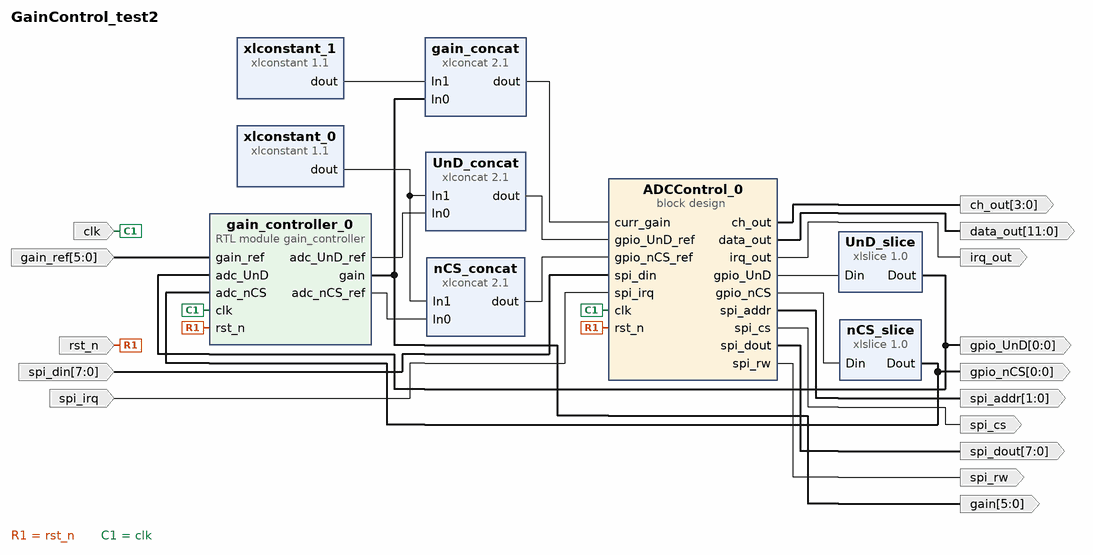
[diagram p0: block diagram of the top level]
# Vivado block design GainControl_test2, xczu3eg-sbva484-1-i, Vivado 2020.2
create_bd_design GainControl_test2

create_bd_port -dir O spi_rw
create_bd_port -dir O spi_cs
create_bd_port -dir O -from 7 -to 0 spi_dout
create_bd_port -dir O irq_out
create_bd_port -dir O -from 1 -to 0 spi_addr
create_bd_port -dir O -from 11 -to 0 data_out
create_bd_port -dir O -from 3 -to 0 ch_out
create_bd_port -dir I -from 7 -to 0 spi_din
create_bd_port -dir I -type rst rst_n
create_bd_port -dir I -type clk clk
create_bd_port -dir I spi_irq
create_bd_port -dir O -from 5 -to 0 gain
create_bd_port -dir I -from 5 -to 0 gain_ref
create_bd_port -dir O -from 0 -to 0 gpio_UnD
create_bd_port -dir O -from 0 -to 0 gpio_nCS

create_bd_cell -type module -reference gain_controller gain_controller_0
create_bd_cell -type ip -vlnv xilinx.com:ip:xlconcat:2.1 UnD_concat
set_property -dict {CONFIG.IN1_WIDTH 3 CONFIG.NUM_PORTS 2} [get_bd_cells UnD_concat]
create_bd_cell -type ip -vlnv xilinx.com:ip:xlconcat:2.1 nCS_concat
set_property -dict {CONFIG.IN1_WIDTH 3 CONFIG.NUM_PORTS 2} [get_bd_cells nCS_concat]
create_bd_cell -type ip -vlnv xilinx.com:ip:xlconstant:1.1 xlconstant_0
set_property -dict {CONFIG.CONST_VAL 0 CONFIG.CONST_WIDTH 3} [get_bd_cells xlconstant_0]
create_bd_cell -type ip -vlnv xilinx.com:ip:xlconcat:2.1 gain_concat
set_property -dict {CONFIG.IN0_WIDTH 6 CONFIG.IN1_WIDTH 18 CONFIG.NUM_PORTS 2} [get_bd_cells gain_concat]
create_bd_cell -type ip -vlnv xilinx.com:ip:xlconstant:1.1 xlconstant_1
set_property -dict {CONFIG.CONST_VAL 0 CONFIG.CONST_WIDTH 18} [get_bd_cells xlconstant_1]
create_bd_cell -type ip -vlnv xilinx.com:ip:xlslice:1.0 UnD_slice
set_property -dict {CONFIG.DIN_WIDTH 4} [get_bd_cells UnD_slice]
create_bd_cell -type ip -vlnv xilinx.com:ip:xlslice:1.0 nCS_slice
set_property -dict {CONFIG.DIN_WIDTH 4} [get_bd_cells nCS_slice]
create_bd_cell -type container -reference ADCControl ADCControl_0
set_property -dict [list \
  CONFIG.ACTIVE_SIM_BD ADCControl.bd \
  CONFIG.ACTIVE_SYNTH_BD ADCControl.bd \
  CONFIG.ENABLE_DFX 0 \
  CONFIG.LIST_SIM_BD ADCControl.bd \
  CONFIG.LIST_SYNTH_BD ADCControl.bd \
  CONFIG.LOCK_PROPAGATE 0 \
] [get_bd_cells ADCControl_0]

# ---- connections ----

connect_bd_net -net rst_n_0_1 [get_bd_ports rst_n] [get_bd_pins gain_controller_0/rst_n] [get_bd_pins ADCControl_0/rst_n]
connect_bd_net -net clk_0_1 [get_bd_ports clk] [get_bd_pins gain_controller_0/clk] [get_bd_pins ADCControl_0/clk]
connect_bd_net -net gain_ref_0_1 [get_bd_ports gain_ref] [get_bd_pins gain_controller_0/gain_ref]
connect_bd_net [get_bd_pins gain_controller_0/adc_UnD_ref] [get_bd_pins UnD_concat/In0]
connect_bd_net [get_bd_pins gain_controller_0/adc_nCS_ref] [get_bd_pins nCS_concat/In0]
connect_bd_net [get_bd_pins xlconstant_0/dout] [get_bd_pins nCS_concat/In1] [get_bd_pins UnD_concat/In1]
connect_bd_net [get_bd_pins gain_controller_0/gain] [get_bd_ports gain] [get_bd_pins gain_concat/In0]
connect_bd_net [get_bd_pins xlconstant_1/dout] [get_bd_pins gain_concat/In1]
connect_bd_net [get_bd_pins UnD_slice/Dout] [get_bd_ports gpio_UnD] [get_bd_pins gain_controller_0/adc_UnD]
connect_bd_net [get_bd_pins nCS_slice/Dout] [get_bd_ports gpio_nCS] [get_bd_pins gain_controller_0/adc_nCS]
connect_bd_net [get_bd_pins ADCControl_0/ch_out] [get_bd_ports ch_out]
connect_bd_net [get_bd_pins ADCControl_0/data_out] [get_bd_ports data_out]
connect_bd_net [get_bd_pins ADCControl_0/irq_out] [get_bd_ports irq_out]
connect_bd_net [get_bd_pins ADCControl_0/spi_addr] [get_bd_ports spi_addr]
connect_bd_net [get_bd_pins ADCControl_0/spi_cs] [get_bd_ports spi_cs]
connect_bd_net [get_bd_pins ADCControl_0/spi_dout] [get_bd_ports spi_dout]
connect_bd_net [get_bd_pins ADCControl_0/spi_rw] [get_bd_ports spi_rw]
connect_bd_net [get_bd_pins ADCControl_0/gpio_UnD] [get_bd_pins UnD_slice/Din]
connect_bd_net [get_bd_pins ADCControl_0/gpio_nCS] [get_bd_pins nCS_slice/Din]
connect_bd_net -net gpio_UnD_ref_1 [get_bd_pins UnD_concat/dout] [get_bd_pins ADCControl_0/gpio_UnD_ref]
connect_bd_net -net gpio_nCS_ref_1 [get_bd_pins nCS_concat/dout] [get_bd_pins ADCControl_0/gpio_nCS_ref]
connect_bd_net -net curr_gain_1 [get_bd_pins gain_concat/dout] [get_bd_pins ADCControl_0/curr_gain]
connect_bd_net [get_bd_ports spi_din] [get_bd_pins ADCControl_0/spi_din]
connect_bd_net [get_bd_ports spi_irq] [get_bd_pins ADCControl_0/spi_irq]

validate_bd_design
save_bd_design
